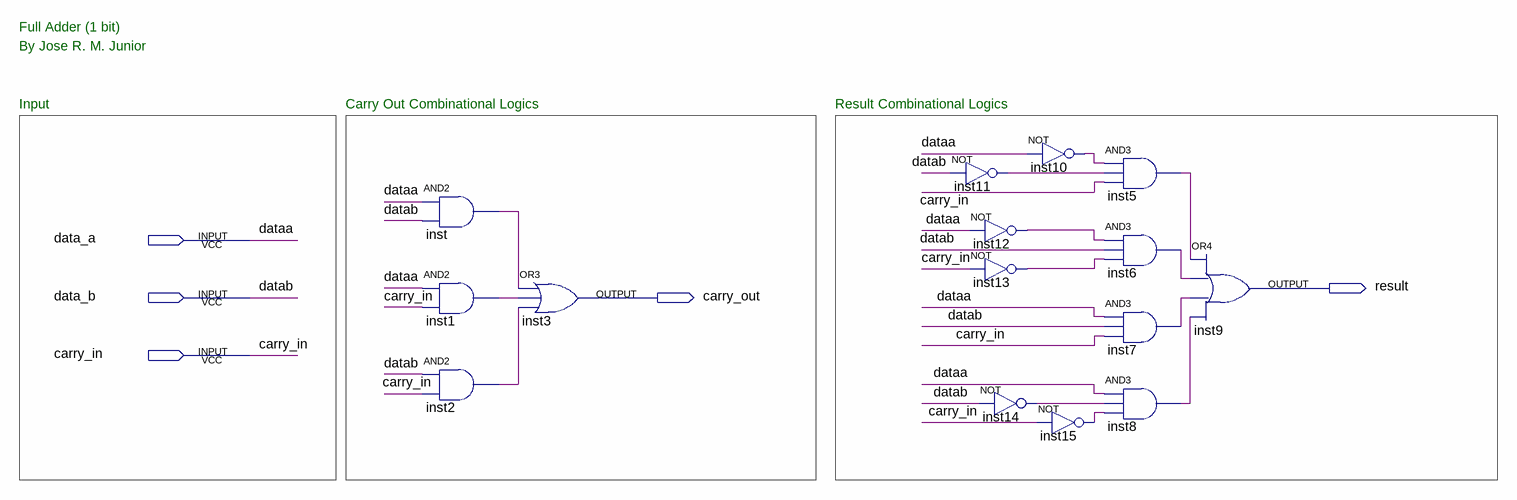
[diagram p0: schematic sheet]
// Quartus schematic full_adder_1bit.bdf as structural Verilog: 15 symbols, 5 pins
module full_adder_1bit (
  input  data_a,
  input  data_b,
  input  carry_in,
  output result,
  output carry_out
);

  wire inst1_out, inst2_out, inst5_out, inst6_out, inst7_out, inst8_out, inst10_out, inst11_out, inst12_out,
       inst13_out, inst14_out, inst15_out, inst_out;

  and inst (inst_out, data_a, data_b);
  and inst1 (inst1_out, data_a, carry_in);
  and inst2 (inst2_out, data_b, carry_in);
  or inst3 (carry_out, inst_out, inst1_out, inst2_out);
  not inst11 (inst11_out, data_b);
  not inst12 (inst12_out, data_a);
  not inst13 (inst13_out, carry_in);
  not inst14 (inst14_out, data_b);
  not inst10 (inst10_out, data_a);
  not inst15 (inst15_out, carry_in);
  and inst5 (inst5_out, inst10_out, inst11_out, carry_in);
  and inst6 (inst6_out, inst12_out, data_b, inst13_out);
  and inst7 (inst7_out, data_a, data_b, carry_in);
  and inst8 (inst8_out, data_a, inst14_out, inst15_out);
  or inst9 (result, inst5_out, inst6_out, inst7_out, inst8_out);

  // Other names for the same wires on the sheet: dataa = data_a; datab = data_b

  // Notes on the sheet:
  //   Full Adder (1 bit)
  //   By Jose R. M. Junior
  //   Input
  //   Carry Out Combinational Logics
  //   Result Combinational Logics
endmodule
